# EAGLE design MultiWiiChassis_quad_power (EAGLE 6.4)
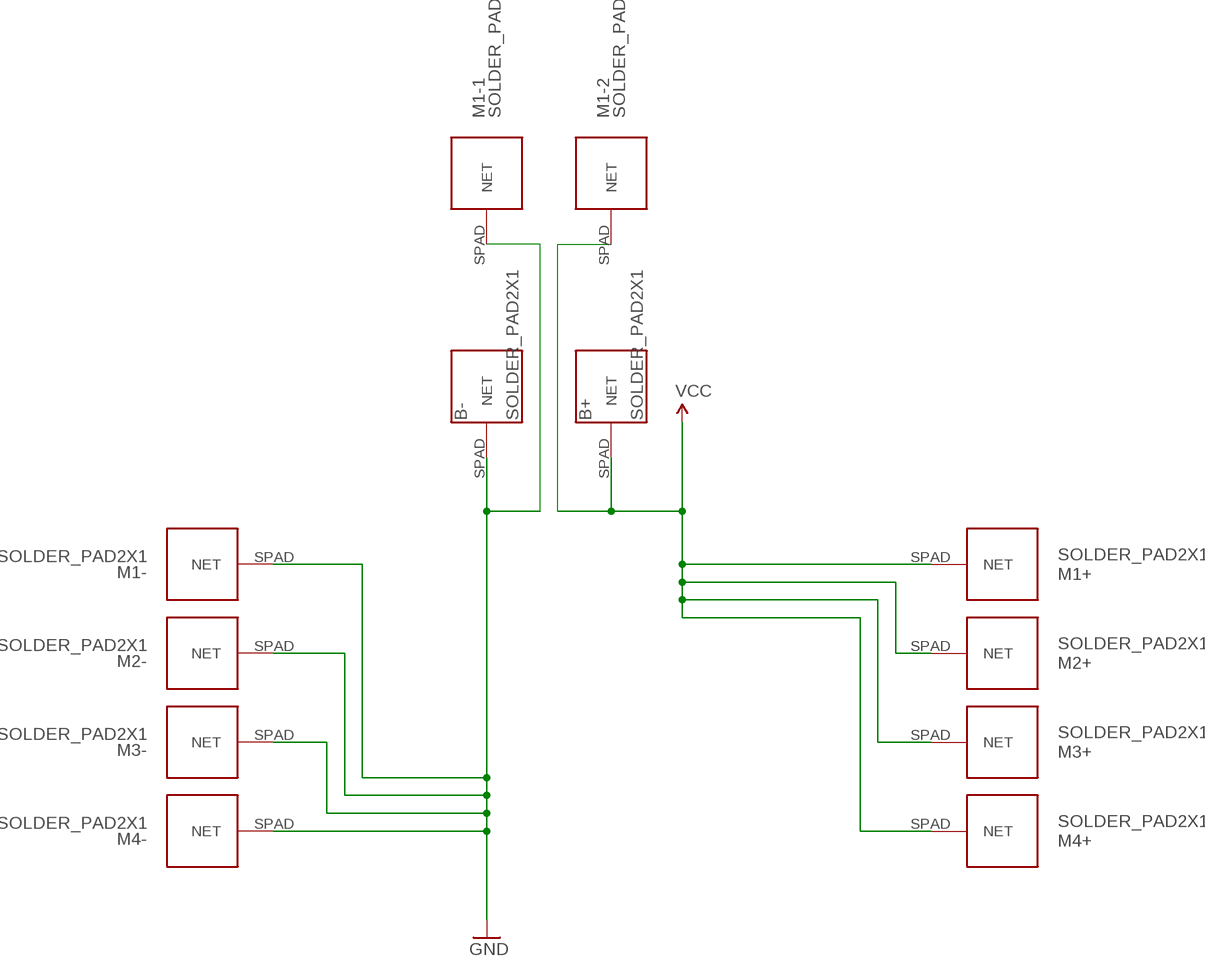
[diagram p0: schematic, sheet 1]

## Parts
B+  SOLDER_PAD2X1  [SOLDER_PAD_2X1]
B-  SOLDER_PAD2X1  [SOLDER_PAD_2X1]
M1+  SOLDER_PAD2X1  [SOLDER_PAD_2X1]
M1-  SOLDER_PAD2X1  [SOLDER_PAD_2X1]
M1-1  SOLDER_PAD  [SOLDER_PAD]
M1-2  SOLDER_PAD  [SOLDER_PAD]
M2+  SOLDER_PAD2X1  [SOLDER_PAD_2X1]
M2-  SOLDER_PAD2X1  [SOLDER_PAD_2X1]
M3+  SOLDER_PAD2X1  [SOLDER_PAD_2X1]
M3-  SOLDER_PAD2X1  [SOLDER_PAD_2X1]
M4+  SOLDER_PAD2X1  [SOLDER_PAD_2X1]
M4-  SOLDER_PAD2X1  [SOLDER_PAD_2X1]

## Nets
GND: B-.SPAD(NET) M1-1.SPAD(NET) M1-.SPAD(NET) M2-.SPAD(NET) M3-.SPAD(NET) M4-.SPAD(NET)
VCC: B+.SPAD(NET) M1+.SPAD(NET) M1-2.SPAD(NET) M2+.SPAD(NET) M3+.SPAD(NET) M4+.SPAD(NET)

## Library data of the parts
B+ B- M1+ M1- M1-1 M1-2 M2+ M2- M3+ M3- M4+ M4- = JCM:SOLDER_PAD

## Board
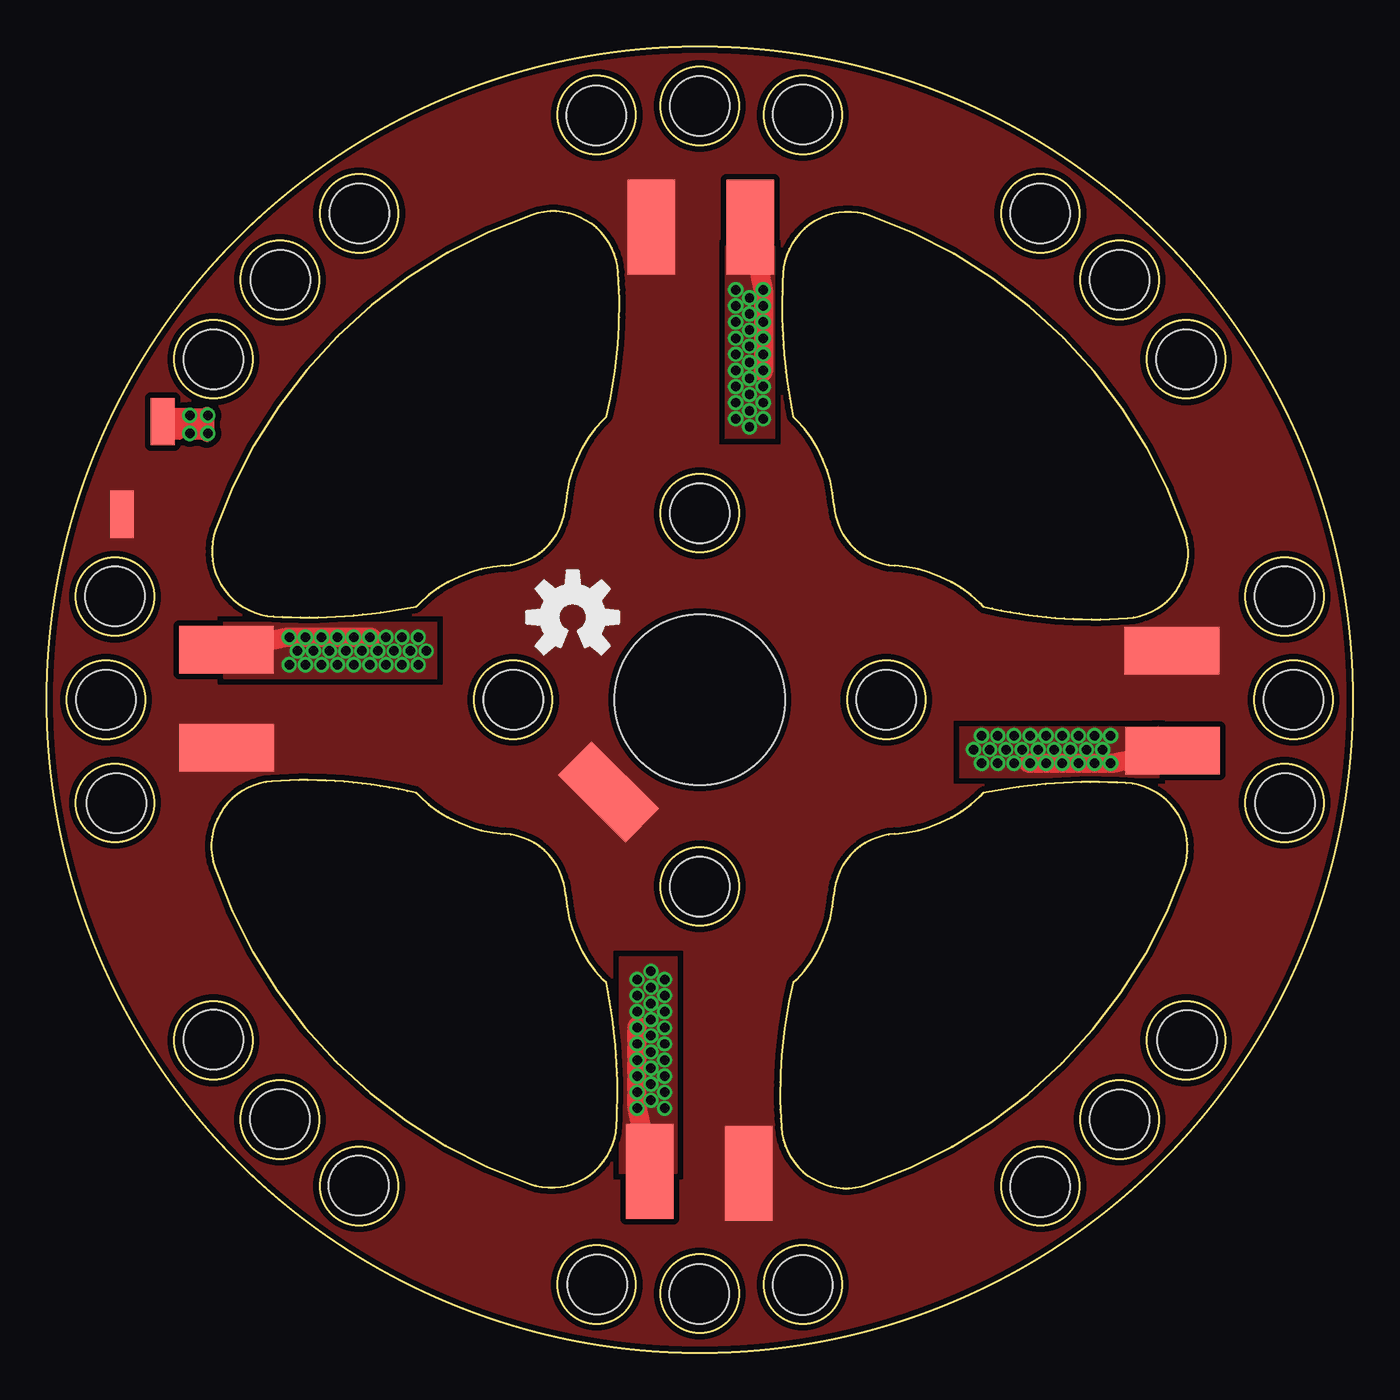
[diagram p1: board, top side]
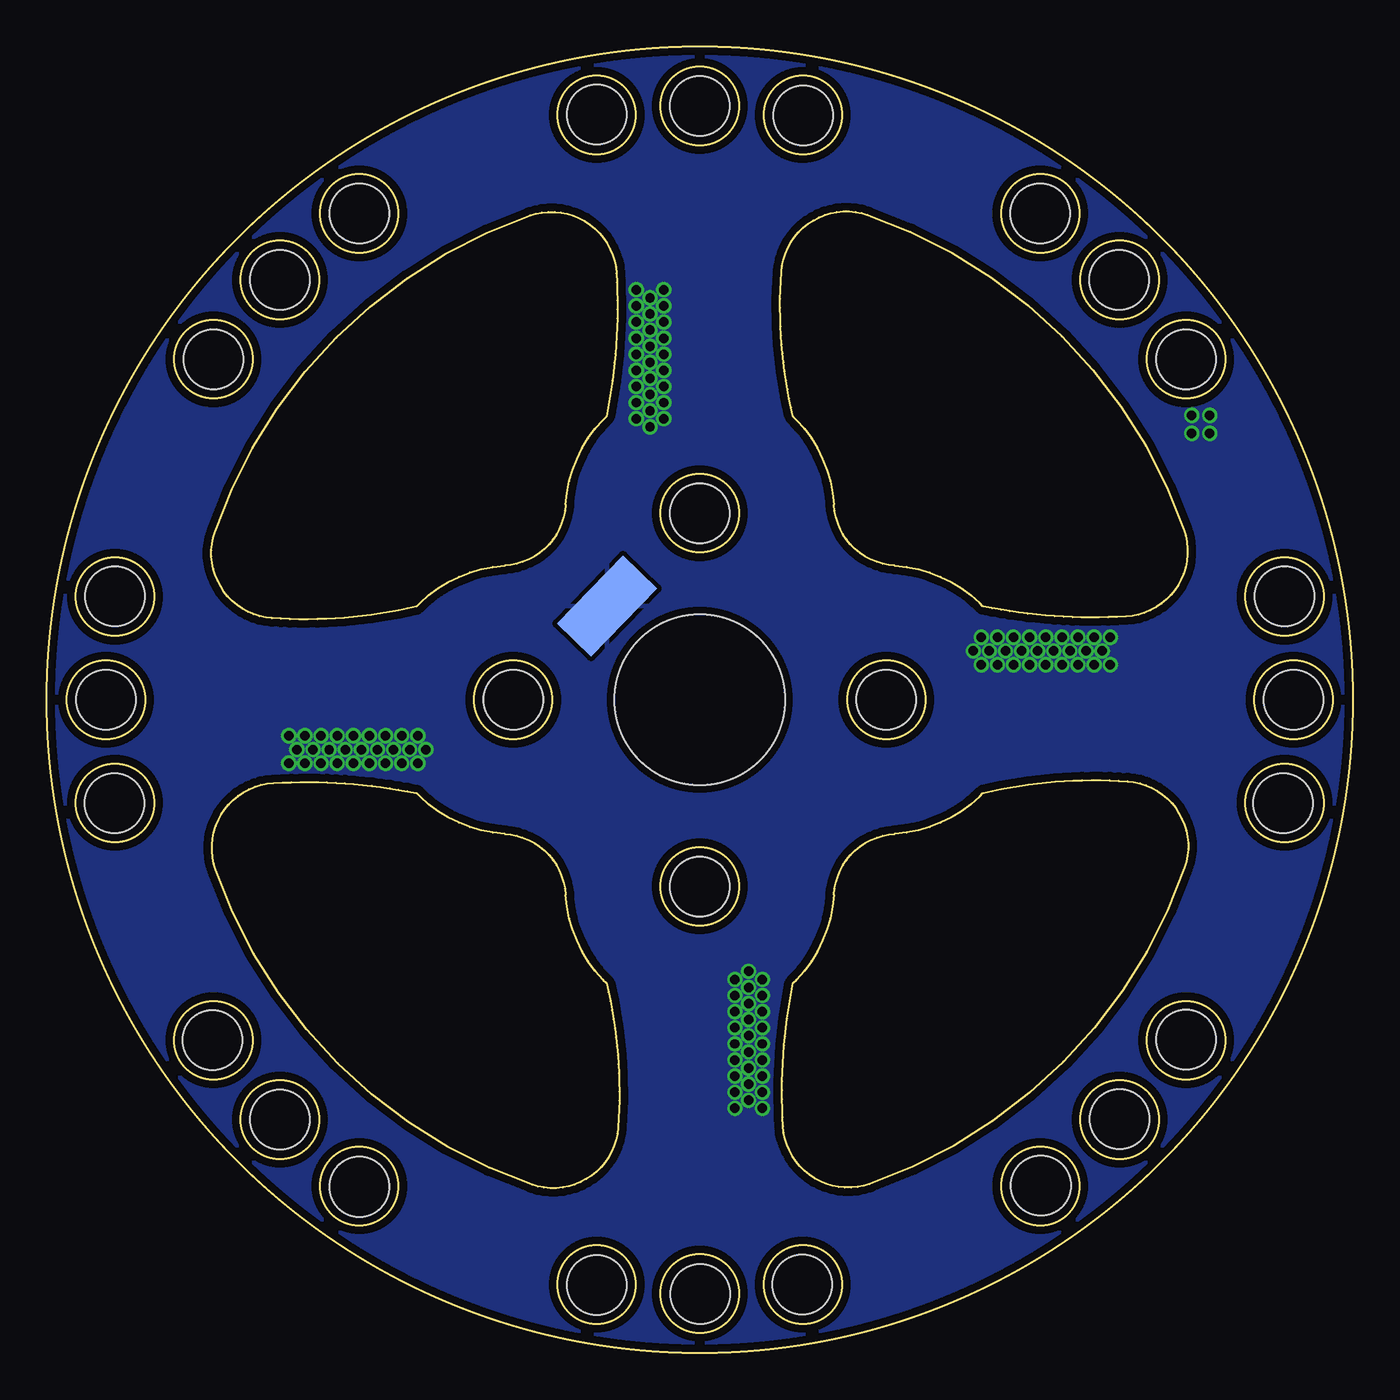
[diagram p2: board, bottom side, seen from below]

Size 70 x 70 mm. Coordinates in mm from the lower left corner, seen from the top.
Outline: 30.54,12.15 30.56,12.63 30.58,13.11 30.59,13.59 30.59,14.07 30.58,14.55 30.57,15.03 30.55,15.51 30.52,15.99 30.48,16.47 30.43,16.95 30.38,17.42 30.32,17.9 30.25,18.38 30.17,18.86 30.09,19.34 30,19.82 29.82,20 arc-40 27.81,24.54 arc83 24.54,27.81 arc-40 20,29.82 19.82,30 19.34,30.11 18.85,30.21 18.37,30.3 17.88,30.38 17.4,30.45 16.91,30.51 16.43,30.56 15.95,30.61 15.46,30.64 14.98,30.67 14.5,30.69 14.01,30.69 13.53,30.69 13.04,30.68 12.56,30.66 12.08,30.63 arc105 9.02,25.99 arc52 25.89,9.05 arc106 30.54,12.15
Outline: 57.85,30.54 57.37,30.56 56.89,30.58 56.41,30.59 55.93,30.59 55.45,30.58 54.97,30.57 54.49,30.55 54.01,30.52 53.53,30.48 53.05,30.43 52.58,30.38 52.1,30.32 51.62,30.25 51.14,30.17 50.66,30.09 50.18,30 50,29.82 arc-40 45.46,27.81 arc83 42.19,24.54 arc-40 40.18,20 40,19.82 39.89,19.34 39.79,18.85 39.7,18.37 39.62,17.88 39.55,17.4 39.49,16.91 39.44,16.43 39.39,15.95 39.36,15.46 39.33,14.98 39.31,14.5 39.31,14.01 39.31,13.53 39.32,13.04 39.34,12.56 39.37,12.08 arc105 44.01,9.02 arc52 60.95,25.89 arc106 57.85,30.54
Outline: 39.46,57.85 39.44,57.37 39.42,56.89 39.41,56.41 39.41,55.93 39.42,55.45 39.43,54.97 39.45,54.49 39.48,54.01 39.52,53.53 39.57,53.05 39.62,52.58 39.68,52.1 39.75,51.62 39.83,51.14 39.91,50.66 40,50.18 40.18,50 arc-40 42.19,45.46 arc83 45.46,42.19 arc-40 50,40.18 50.18,40 50.66,39.89 51.15,39.79 51.63,39.7 52.12,39.62 52.6,39.55 53.09,39.49 53.57,39.44 54.05,39.39 54.54,39.36 55.02,39.33 55.5,39.31 55.99,39.31 56.47,39.31 56.96,39.32 57.44,39.34 57.92,39.37 arc105 60.98,44.01 arc52 44.12,60.95 arc106 39.46,57.85
Outline: 12.15,39.46 12.63,39.44 13.11,39.42 13.59,39.41 14.07,39.41 14.55,39.42 15.03,39.43 15.51,39.45 15.99,39.48 16.47,39.52 16.95,39.57 17.42,39.62 17.9,39.68 18.38,39.75 18.86,39.83 19.34,39.91 19.82,40 20,40.18 arc-40 24.54,42.19 arc83 27.81,45.46 arc-40 29.82,50 30,50.18 30.11,50.66 30.21,51.15 30.3,51.63 30.38,52.12 30.45,52.6 30.51,53.09 30.56,53.57 30.61,54.05 30.64,54.54 30.67,55.02 30.69,55.5 30.69,55.99 30.69,56.47 30.68,56.96 30.66,57.44 30.63,57.92 arc105 25.99,60.98 arc52 9.05,44.12 arc106 12.15,39.46
Outline: circle at 35,25 radius 2.1
Outline: circle at 45,35 radius 2.1
Outline: circle at 35,45 radius 2.1
Outline: circle at 25,35 radius 2.1
Outline: circle at 16.75,8.93 radius 2.1
Outline: circle at 8.93,16.75 radius 2.1
Outline: circle at 40.53,3.66 radius 2.1
Outline: circle at 29.47,3.66 radius 2.1
Outline: circle at 61.07,16.75 radius 2.1
Outline: circle at 53.25,8.93 radius 2.1
Outline: circle at 66.34,40.53 radius 2.1
Outline: circle at 66.34,29.47 radius 2.1
Outline: circle at 12.5,57.5 radius 2.1
Outline: circle at 12.5,12.5 radius 2.1
Outline: circle at 57.5,12.5 radius 2.1
Outline: circle at 57.5,57.5 radius 2.1
Outline: circle at 53.25,61.07 radius 2.1
Outline: circle at 61.07,53.25 radius 2.1
Outline: circle at 29.47,66.34 radius 2.1
Outline: circle at 40.53,66.34 radius 2.1
Copper layers (1*16): Top 0.035mm / dielectric 1.5mm / Bottom 0.035mm
Design rules "Fusion_eagle_rule_v1.1": minimum track width 6mil, minimum drill 12mil, track to track 6mil, track to pad 6mil, pad to pad 6mil, via to via 6mil, smd to smd 0mil, copper to edge 10mil, drill to drill 10mil, minimum pad ring 10mil, minimum via ring 6mil, stop-mask expansion 2mil, vias tented up to drill 100mil, thermal gap 10mil
Holes 3.2 mm at 35,66.82 66.82,35 34.97,3.15 3.18,35 12.5,12.53 12.53,57.5 57.5,12.5 3.65,40.54 3.73,29.46 57.51,57.5 29.46,66.31 40.51,66.36 45,35 66.34,40.54 66.36,29.46 29.51,3.66 40.51,3.64 25,35 35.01,44.98 35.01,24.99 53.24,8.9 61.11,16.77 61.05,53.24 53.23,61.06 16.76,61.06 8.93,53.24 8.94,16.79 16.72,8.97
Holes 9.14 mm at 35,35
vRestrict: 3 lines

### Footprints (pad centres in the part's own frame; a part is rotated, then mirrored left to right if it is on the bottom)
SOLDER_PAD_2X1 = smd 5.08 x 2.54: SPAD 0,0
SOLDER_PAD = smd 2.54 x 1.27: SPAD 0,0

### Placement (x,y rotation side)
B+  30.11,30.06 315 top
B-  39.97,40.02 46 bottom
M1+  32.41,60.32 90 top
M1-  37.72,60.32 90 top
M1-1  6.22,49.91 90 top
M1-2  4.04,44.93 90 top
M2+  9.64,32.43 0 top
M2-  9.63,37.67 0 top
M3+  37.63,9.62 90 top
M3-  32.33,9.73 90 top
M4+  60.3,37.62 0 top
M4-  60.34,32.28 0 top
U$2  [OSHW-LOGO-M]  28.19,39.42 0 top

### Tracks (layer width: path | path; a pad name or v marks a point on that pad's centre or on a via)
GND  (via drill 0.51)
  Top 0.813: v7.67,50.24 8.53,50.24 8.58,50.29 8.58,49.32 | 8.58,49.32 8.58,49.27 | 8.58,49.22 8.58,49.27 | 8.58,49.27 7.67,50.19 7.72,50.19 8.58,49.32 | 8.58,49.32 7.72,49.32 v7.67,49.27 v7.67,50.24 | v7.67,50.24 6.96,50.24 6.96,49.43 7.06,49.32 6.8,49.32 M1-1.SPAD
  Top 1.016: 17.4,38.35 v13,38.35 M2-.SPAD | 31.65,17.5 v31.65,13.1 M3-.SPAD | 52.63,31.59 v57.02,31.59 60.39,32.28 | 38.4,52.58 v38.4,56.97 37.72,60.34
  other vias: 13.87,38.35 14.73,38.35 15.59,38.35 16.46,38.35 17.32,38.35 18.18,38.35 19.05,38.35 19.91,38.35 13.43,37.61 14.3,37.61 15.16,37.61 16.02,37.61 16.89,37.61 17.75,37.61 18.62,37.61 19.48,37.61 20.34,37.61 13,36.88 13.87,36.88 14.73,36.88 15.59,36.88 16.46,36.88 17.32,36.88 18.18,36.88 19.05,36.88 19.91,36.88 31.65,13.97 31.65,14.83 31.65,15.69 31.65,16.56 31.65,17.42 31.65,18.29 31.65,19.15 31.65,20.01 32.38,13.54 32.38,14.4 32.38,15.26 32.38,16.13 32.38,16.99 32.38,17.85 32.38,18.72 32.38,19.58 32.38,20.44 33.12,13.1 33.12,13.97 33.12,14.83 33.12,15.69 33.12,16.56 33.12,17.42 33.12,18.29 33.12,19.15 33.12,20.01 56.16,31.59 55.29,31.59 54.43,31.59 53.57,31.59 52.7,31.59 51.84,31.59 50.98,31.59 50.11,31.59 56.59,32.33 55.72,32.33 54.86,32.33 54,32.33 53.13,32.33 52.27,32.33 51.41,32.33 50.54,32.33 49.68,32.33 57.02,33.07 56.16,33.07 55.29,33.07 54.43,33.07 53.57,33.07 52.7,33.07 51.84,33.07 50.98,33.07 50.11,33.07 38.4,56.11 38.4,55.24 38.4,54.38 38.4,53.52 38.4,52.65 38.4,51.79 38.4,50.92 38.4,50.06 37.67,56.54 37.67,55.67 37.67,54.81 37.67,53.95 37.67,53.08 37.67,52.22 37.67,51.36 37.67,50.49 37.67,49.63 36.93,56.97 36.93,56.11 36.93,55.24 36.93,54.38 36.93,53.52 36.93,52.65 36.93,51.79 36.93,50.92 36.93,50.06 8.63,50.24 8.63,49.27
  pour Bottom (isolate 0.406): -3,73.2 73.2,73.2 73.1,-3.1 -3.1,-3.1
  pour Top (isolate 0.051, no thermals): 36.37,59.28 36.37,49.04 39.01,49.04 39.01,59.28
  pour Top (no thermals): 59.59,33.55 59.59,30.83 48.97,30.83 48.97,33.55 59.56,33.55
  pour Top (no thermals): 30.73,9.67 30.73,21.23 33.75,21.23 33.75,9.62 30.68,9.62
  pour Top (no thermals): 9.5,39.14 9.5,36.17 20.9,36.17 20.9,39.11 9.52,39.11
VCC
  pour Top (isolate 0.305, rank 2, no thermals): 73.2,73.2 73.1,-3.1 -3.1,-3.1 -3,73.2

### Text on the board
tDocu: Quad Power v2 | - | + | Engineering LLC | J Moreland | MultiWiiChassis